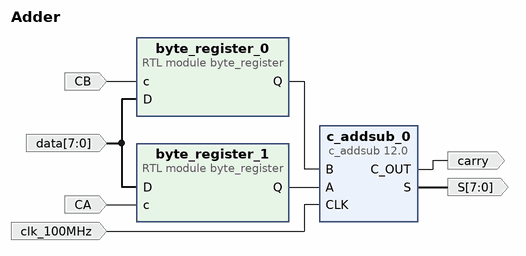
[diagram p0: block diagram of the top level]
# Vivado block design Adder, xc7z020clg484-1, Vivado 2024.1
create_bd_design Adder

create_bd_port -dir I -from 7 -to 0 data
create_bd_port -dir O -from 7 -to 0 S
create_bd_port -dir I CA
create_bd_port -dir I CB
create_bd_port -dir I -type clk clk_100MHz
set_property -dict {CONFIG.FREQ_HZ 100000000} [get_bd_ports clk_100MHz]
create_bd_port -dir O carry

create_bd_cell -type ip -vlnv xilinx.com:ip:c_addsub:12.0 c_addsub_0
set_property -dict [list \
  CONFIG.A_Type Unsigned \
  CONFIG.A_Width 8 \
  CONFIG.B_Constant false \
  CONFIG.B_Type Unsigned \
  CONFIG.B_Value 00000000 \
  CONFIG.B_Width 8 \
  CONFIG.CE false \
  CONFIG.C_Out true \
  CONFIG.Latency 1 \
  CONFIG.Out_Width 8 \
  CONFIG.SCLR false \
  CONFIG.SSET false \
] [get_bd_cells c_addsub_0]
create_bd_cell -type module -reference byte_register byte_register_0
create_bd_cell -type module -reference byte_register byte_register_1

# ---- connections ----

connect_bd_net [get_bd_ports CA] [get_bd_pins byte_register_1/c]
connect_bd_net [get_bd_ports CB] [get_bd_pins byte_register_0/c]
connect_bd_net [get_bd_pins byte_register_0/Q] [get_bd_pins c_addsub_0/B]
connect_bd_net [get_bd_pins byte_register_1/Q] [get_bd_pins c_addsub_0/A]
connect_bd_net [get_bd_pins c_addsub_0/C_OUT] [get_bd_ports carry]
connect_bd_net [get_bd_pins c_addsub_0/S] [get_bd_ports S]
connect_bd_net [get_bd_ports clk_100MHz] [get_bd_pins c_addsub_0/CLK]
connect_bd_net [get_bd_ports data] [get_bd_pins byte_register_1/D] [get_bd_pins byte_register_0/D]

validate_bd_design
save_bd_design
